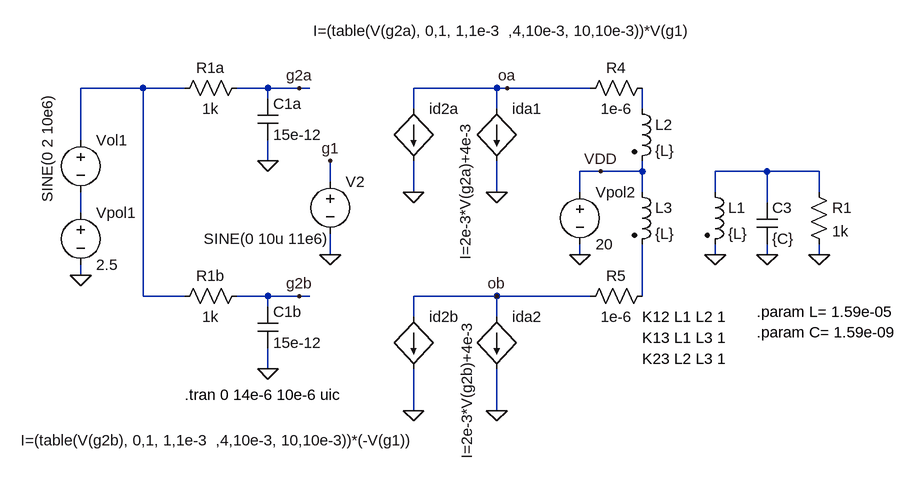
[diagram p0: schematic dual_simula.asc]
dual_simula.asc, the LTspice schematic file:
Version 4
SHEET 1 2380 680
WIRE -288 0 -384 0
WIRE -224 0 -288 0
WIRE -96 0 -144 0
WIRE -48 0 -96 0
WIRE -32 0 -48 0
WIRE 256 0 128 0
WIRE 272 0 256 0
WIRE 400 0 272 0
WIRE -96 16 -96 0
WIRE 128 32 128 0
WIRE 256 32 256 0
WIRE 480 32 480 0
WIRE -384 80 -384 0
WIRE -96 112 -96 80
WIRE 416 128 384 128
WIRE 480 128 480 112
WIRE 480 128 416 128
WIRE 672 128 592 128
WIRE 752 128 672 128
WIRE 0 144 0 112
WIRE 128 160 128 112
WIRE 256 160 256 112
WIRE 384 160 384 128
WIRE 480 160 480 128
WIRE 592 160 592 128
WIRE 752 160 752 128
WIRE 672 176 672 128
WIRE -384 192 -384 160
WIRE 0 256 0 224
WIRE 384 256 384 240
WIRE 592 256 592 240
WIRE 672 256 672 240
WIRE 752 256 752 240
WIRE -384 288 -384 272
WIRE -288 320 -288 0
WIRE -224 320 -288 320
WIRE -96 320 -144 320
WIRE -48 320 -96 320
WIRE -32 320 -48 320
WIRE 256 320 128 320
WIRE 400 320 256 320
WIRE 480 320 480 240
WIRE -96 336 -96 320
WIRE 128 352 128 320
WIRE 256 352 256 320
WIRE -96 432 -96 400
WIRE 128 496 128 432
WIRE 256 496 256 432
FLAG 128 160 0
FLAG 752 256 0
FLAG -48 0 g2a
FLAG 0 256 0
FLAG 0 112 g1
FLAG 592 256 0
FLAG 672 256 0
FLAG 272 0 oa
FLAG -96 112 0
FLAG -48 320 g2b
FLAG -96 432 0
FLAG 128 496 0
FLAG 256 320 ob
FLAG -384 288 0
FLAG 416 128 VDD
FLAG 384 256 0
FLAG 256 160 0
FLAG 256 496 0
SYMBOL bi 128 32 R0
WINDOW 3 435 -120 Right 2
SYMATTR Value I=(table(V(g2a), 0,1, 1,1e-3  ,4,10e-3, 10,10e-3))*V(g1)
SYMATTR InstName id2a
SYMBOL res 736 144 R0
SYMATTR InstName R1
SYMATTR Value 1k
SYMBOL voltage 0 128 R0
WINDOW 3 -195 104 Left 2
WINDOW 123 0 0 Left 0
WINDOW 39 0 0 Left 0
SYMATTR Value SINE(0 10u 11e6)
SYMATTR InstName V2
SYMBOL ind2 576 144 R0
SYMATTR InstName L1
SYMATTR Value {L}
SYMATTR Type ind
SYMBOL cap 656 176 R0
SYMATTR InstName C3
SYMATTR Value {C}
SYMBOL res -128 -16 R90
WINDOW 0 0 56 VBottom 2
WINDOW 3 32 56 VTop 2
SYMATTR InstName R1a
SYMATTR Value 1k
SYMBOL cap -112 16 R0
SYMATTR InstName C1a
SYMATTR Value 15e-12
SYMBOL res -128 304 R90
WINDOW 0 0 56 VBottom 2
WINDOW 3 32 56 VTop 2
SYMATTR InstName R1b
SYMATTR Value 1k
SYMBOL cap -112 336 R0
SYMATTR InstName C1b
SYMATTR Value 15e-12
SYMBOL bi 128 352 R0
WINDOW 3 10 190 Right 2
SYMATTR Value I=(table(V(g2b), 0,1, 1,1e-3  ,4,10e-3, 10,10e-3))*(-V(g1))
SYMATTR InstName id2b
SYMBOL ind2 464 16 R0
SYMATTR InstName L2
SYMATTR Value {L}
SYMATTR Type ind
SYMATTR SpiceLine Rser=0
SYMBOL ind2 464 144 R0
SYMATTR InstName L3
SYMATTR Value {L}
SYMATTR Type ind
SYMATTR SpiceLine Rser=0
SYMBOL voltage -384 64 R0
WINDOW 3 -51 112 VLeft 2
WINDOW 123 0 0 Left 0
WINDOW 39 0 0 Left 0
SYMATTR Value SINE(0 2 10e6)
SYMATTR InstName Vol1
SYMBOL voltage -384 176 R0
WINDOW 123 0 0 Left 0
WINDOW 39 0 0 Left 0
SYMATTR InstName Vpol1
SYMATTR Value 2.5
SYMBOL voltage 384 144 R0
WINDOW 123 0 0 Left 0
WINDOW 39 0 0 Left 0
SYMATTR InstName Vpol2
SYMATTR Value 20
SYMBOL bi 256 32 R0
WINDOW 3 -48 233 VLeft 2
SYMATTR Value I=2e-3*V(g2a)+4e-3
SYMATTR InstName ida1
SYMBOL bi 256 352 R0
WINDOW 3 -46 219 VLeft 2
SYMATTR Value I=2e-3*V(g2b)+4e-3
SYMATTR InstName ida2
SYMBOL res 384 16 R270
WINDOW 0 32 56 VTop 2
WINDOW 3 0 56 VBottom 2
SYMATTR InstName R4
SYMATTR Value 1e-6
SYMBOL res 384 336 R270
WINDOW 0 32 56 VTop 2
WINDOW 3 0 56 VBottom 2
SYMATTR InstName R5
SYMATTR Value 1e-6
TEXT -224 472 Left 2 !.tran 0 14e-6 10e-6 uic
TEXT 480 352 Left 2 !K12 L1 L2 1
TEXT 480 384 Left 2 !K13 L1 L3 1
TEXT 480 416 Left 2 !K23 L2 L3 1
TEXT 656 344 Left 2 !.param L= 1.59e-05 \n.param C= 1.59e-09

The netlist it stands for:
* dual_simula.asc
B§id2a oa 0 I=(table(V(g2a), 0,1, 1,1e-3  ,4,10e-3, 10,10e-3))*V(g1)
R1 N003 0 1k
V2 g1 0 SINE(0 10u 11e6)
L1 N003 0 {L}
C3 N003 0 {C}
R1a g2a N001 1k
C1a g2a 0 15e-12
R1b g2b N001 1k
C1b g2b 0 15e-12
B§id2b ob 0 I=(table(V(g2b), 0,1, 1,1e-3  ,4,10e-3, 10,10e-3))*(-V(g1))
L2 N002 VDD {L} Rser=0
L3 VDD N005 {L} Rser=0
Vol1 N001 N004 SINE(0 2 10e6)
Vpol1 N004 0 2.5
Vpol2 VDD 0 20
B§ida1 oa 0 I=2e-3*V(g2a)+4e-3
B§ida2 ob 0 I=2e-3*V(g2b)+4e-3
R4 oa N002 1e-6
R5 ob N005 1e-6
.tran 0 14e-6 10e-6 uic
K12 L1 L2 1
K13 L1 L3 1
K23 L2 L3 1
.param L= 1.59e-05
.param C= 1.59e-09
.backanno
.end